# EAGLE design POTENCIOMETRO (EAGLE 9.5.2)
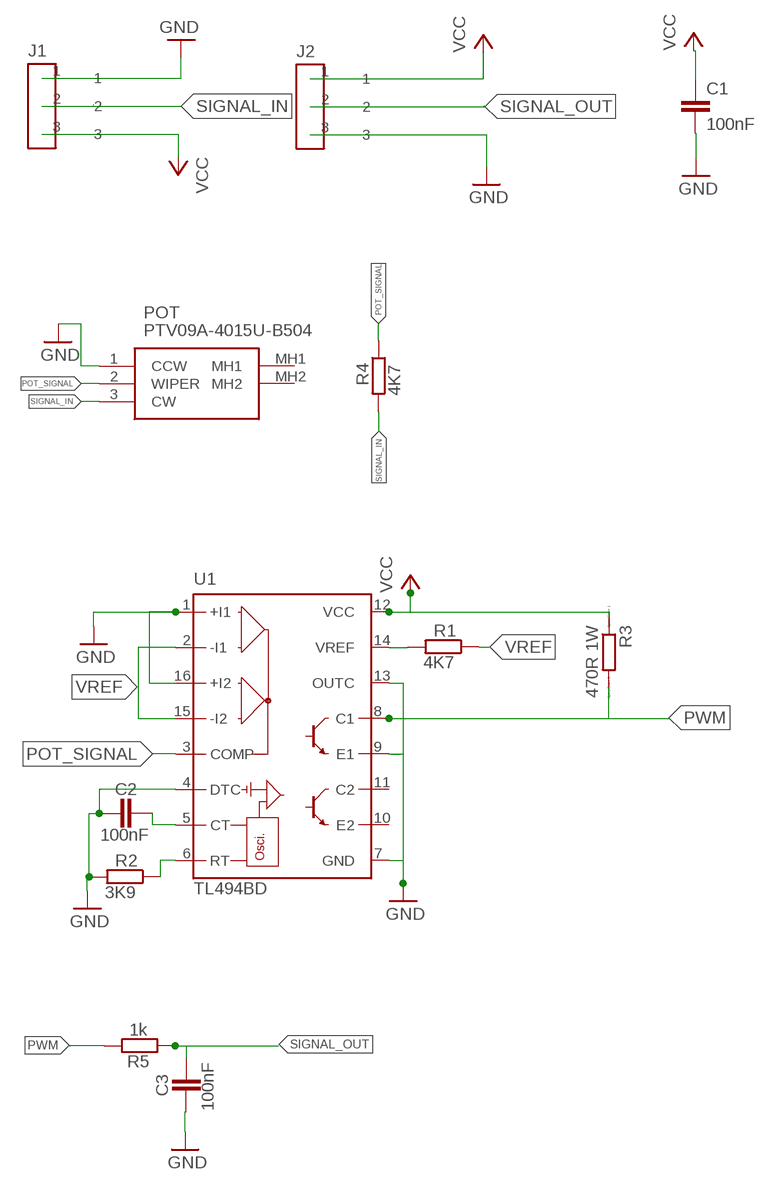
[diagram p0: schematic, sheet 1]

## Parts
C1  100nF  C-EUC0805  [C0805]
C2  100nF  C-EUC0805  [C0805]
C3  100nF  C-EUC0805  [C0805]
J1  CONECTOR_MACHO  [3CONECTOR]
J2  CONECTOR_FEMEA  [3CONECTOR]
POT  PTV09A-4015U-B504  [PTV09A4015UB104]
R1  4K7  R-EU_R0805W  [R0805W]
R2  3K9  R-EU_R0805W  [R0805W]
R3  470R 1W  RR2512  [R2512]
R4  4K7  R-EU_R0805W  [R0805W]
R5  1k  R-EU_R0805W  [R0805W]
U1  TL494BD  [SO16]

## Nets
GND: C1.2 C2.1 C3.1 J1.1 J2.3 POT.1(CCW) R2.2 U1.1(+I1) U1.4(DTC) U1.7(GND) U1.9(E1) U1.13(OUTC) U1.16(+I2)
N$2: C2.2 U1.5(CT)
N$3: R1.2 U1.14(VREF)
N$4: R2.1 U1.6(RT)
POT_SIGNAL: POT.2(WIPER) R4.1 U1.3(COMP)
PWM: R3.2 R5.1 U1.8(C1)
SIGNAL_IN: J1.2 POT.3(CW) R4.2
SIGNAL_OUT: C3.2 J2.2 R5.2
VCC: C1.1 J1.3 J2.1 R3.1 U1.12(VCC)
VREF: R1.1 U1.2(-I1) U1.15(-I2)
Unconnected: POT.MH1 POT.MH2 U1.10(E2) U1.11(C2)

## Library data of the parts
C1-C3 = rcl:C-EU: CAPACITOR, European symbol; SPICEPREFIX: C
J1 = Eletroblocks Lib:CONECTOR_MACHO
J2 = Eletroblocks Lib:CONECTOR_FEMEA
POT = PTV09A-4015U-B504:PTV09A-4015U-B504: Potentiometers PANEL CONTROL - 9MM-ST-CA Source: Datasheet <https://www.mouser.in/datasheet/2/54/ptv09-777818.pdf>; ARROW_PART_NUMBER: PTV09A-4015U-B504; DESCRIPTION: Potentiometers PANEL CONTROL - 9MM-ST-CA; HEIGHT: 15.5mm; MANUFACTURER_NAME: Bourns; MANUFACTURER_PART_NUMBER: PTV09A-4015U-B504; MOUSER_PART_NUMBER: 652-PTV09A-4015UB504; MOUSER_PRICE-STOCK: https://www.mouser.co.uk/ProductDetail/Bourns/PTV09A-4015U-B504?qs=pxDZlBjcsCherlTtJcuegw%3D%3D
R1 R2 R4 R5 = rcl:R-EU_: RESISTOR, European symbol; SPICEPREFIX: R
R3 = eagle-ltspice:R: RESISTOR, European symbol; SPICEMODEL: NONE; SPICEPREFIX: R
U1 = linear:TL494*: SWITCHMODE Pulse Width Modulation Control Circuit NCV494B http://onsemi.com tl494-d.pdf

## Board
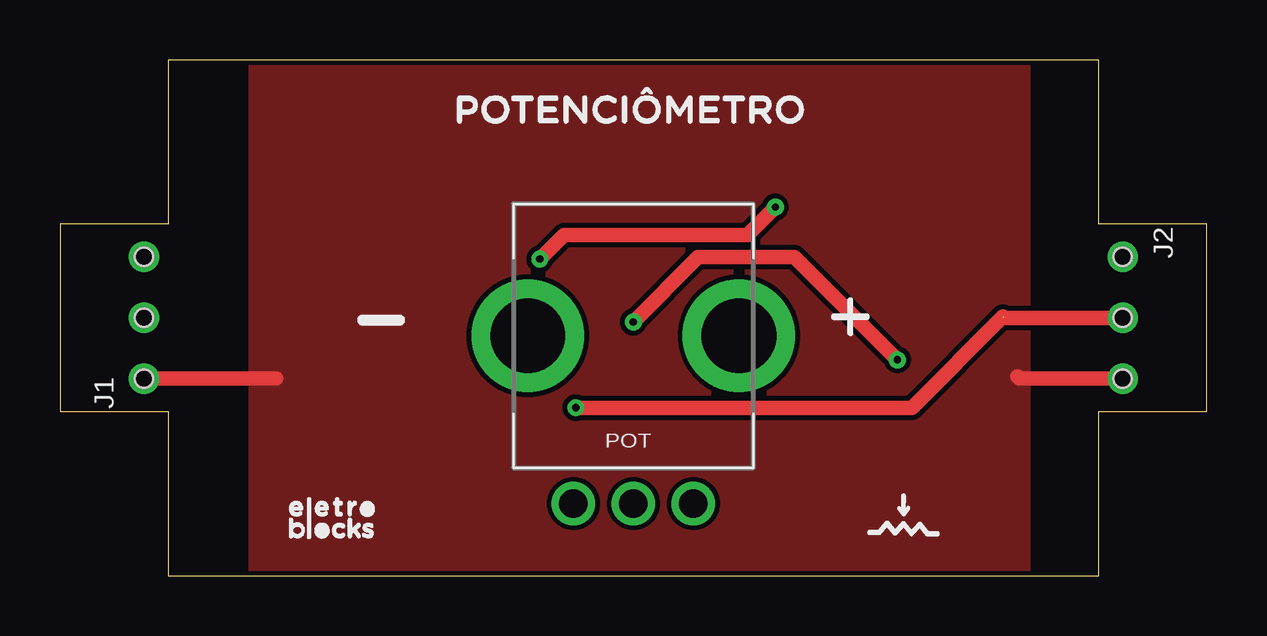
[diagram p1: board, top side]
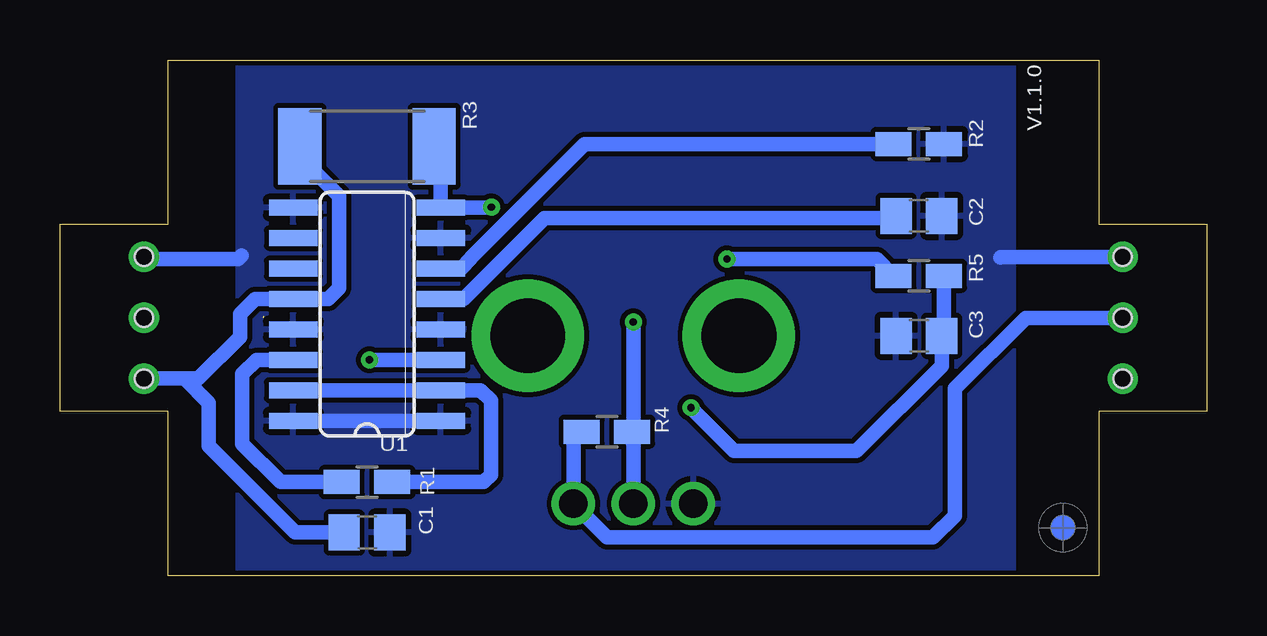
[diagram p2: board, bottom side, seen from below]

Size 47.8 x 21.5 mm. Coordinates in mm from the lower left corner, seen from the top.
Outline: 4.5,0 43.3,0 43.3,6.85 47.8,6.85 47.8,14.65 43.3,14.65 43.3,21.5 4.5,21.5 4.5,14.65 0,14.65 0,6.85 4.5,6.85 4.5,0
Copper layers (1*16): Top 0.035mm / dielectric 1.5mm / Bottom 0.035mm
Design rules "default *": minimum track width 6mil, minimum drill 0.35mm, track to track 8mil, track to pad 8mil, pad to pad 8mil, via to via 8mil, smd to smd 8mil, copper to edge 8mil, drill to drill 8mil, minimum pad ring 10mil, minimum via ring 8mil, stop-mask expansion 4mil, vias tented up to drill 3mm, thermal gap 10mil

### Footprints (pad centres in the part's own frame; a part is rotated, then mirrored left to right if it is on the bottom)
C0805 = smd 1.3 x 1.5: 1 -0.95,0; 2 0.95,0
3CONECTOR = drill 0.75: 1 0,2.54; 2 0,0; 3 0,-2.54 | hole 0.75: 0,2.54; 0,0; 0,-2.54
PTV09A4015UB104 = drill 1.2 pad 1.8: 1 0,0; 2 2.5,0; 3 5,0 | drill 3.124 pad 4.686: MH1 -1.9,7; MH2 6.9,7
R0805W = smd 1.5 x 1: 1 -1.052,0; 2 1.052,0
R2512 = smd 1.8 x 3.2: 1 -2.8,0; 2 2.8,0
SO16 = smd 0.66 x 2.032: 1 -4.445,-3.073; 2 -3.175,-3.073; 3 -1.905,-3.073; 4 -0.635,-3.073; 5 0.635,-3.073; 6 1.905,-3.073; 7 3.175,-3.073; 8 4.445,-3.073; 9 4.445,3.073; 10 3.175,3.073; 11 1.905,3.073; 12 0.635,3.073; 13 -0.635,3.073; 14 -1.905,3.073; 15 -3.175,3.073; 16 -4.445,3.073

### Placement (x,y rotation side)
C1  35,1.8 0 bottom
C2  12,15 180 bottom
C3  12,10 0 bottom
J1  3.5,10.75 0 top
J2  44.3,10.75 180 top
POT  21.4,3 0 top
R1  35,3.9 180 bottom
R2  12,18 0 bottom
R3  35,17.9 0 bottom
R4  25,6 180 bottom
R5  12,12.5 0 bottom
U1  35,10.9 90 bottom
U$1  [FIDUCIAL_G10]  6,2 0 bottom

### Tracks (layer width: path | path; a pad name or v marks a point on that pad's centre or on a via)
GND
  Bottom 0.61: J1.1 8.58,13.29 8.61,13.26 | J2.3 44.2,13.19 40.37,13.19 40.22,13.34 | U1.1 U1.16
  pour Bottom: 8.03,-0.04 8.03,21.44 8.07,21.48 40.32,21.48 40.4,21.41 40.4,-0.04
N$2
  Bottom 0.61: C2.2 13.05,14.9 27.6,14.9 30.97,11.54 U1.5
N$3
  Bottom 0.61: U1.14 39.61,8.99 40.2,8.4 40.2,5.5 38.6,3.9 R1.2
N$4
  Bottom 0.61: R2.1 25.93,18 30.66,13.27 30.66,13.23 31.09,12.8 U1.6
POT_SIGNAL  (via drill 0.3)
  Top 0.61: v34.9,9 30.62,13.28 26.6,13.28 v23.9,10.58
  Bottom 0.61: U1.3 v34.9,9 | POT.2 23.9,5.35 R4.1 23.9,6.05 v23.9,10.58
PWM  (via drill 0.3)
  Top 0.61: v29.82,15.36 28.66,14.2 21,14.2 v20,13.2
  Bottom 0.61: R3.2 31.93,17.63 U1.8 29.84,15.35 v29.82,15.36 | v20,13.2 13.75,13.2 R5.1
SIGNAL_IN
  Bottom 0.61: 3.53,10.78 J1.2 7.55,10.75 10.5,7.8 10.5,2.5 11.41,1.59 20.82,1.59 | 20.82,1.59 20.81,1.6 | 20.82,1.59 21.8,1.59 24.99,1.59 POT.3 26.4,5.75 R4.2
SIGNAL_OUT  (via drill 0.3)  (1 unrouted)
  Top 0.61: v21.5,7 35.5,7 39.3,10.8 | J2.2 39.35,10.75
  Bottom 0.61: R5.2 10.95,10.1 C3.2 11.05,8.75 14.6,5.2 19.7,5.2 v21.5,7
VCC
  Top 0.61: J1.3 9.01,8.21 | J2.1 39.99,8.21 39.9,8.3
  Bottom 0.61: C1.1 36.28,1.89 | R3.1 37.58,17.81 | R3.1 37.8,17.46 36.17,15.83 36.17,11.99 36.62,11.54 U1.12 39.66,11.54 40.3,10.9 40.3,9.95 42.04,8.21 42.61,8.21 | 35.99,1.76 C1.1 | C1.1 36.07,1.68 | J2.1 42.61,8.21 | C1.1 38,1.8 41.6,5.4 41.6,7.2 42.61,8.21 | R3.1 37.4,17.5
  pour Top: 8,0 8,21.4 40.3,21.4 40.3,0.1 8.1,0.1
VREF
  Bottom 0.61: U1.15 U1.2 30.27,7.72 29.84,7.3 29.84,4.2 30.14,3.9 R1.1

### Text on the board
bPlace: V1.1.0